# EAGLE schematic OpenHealth_rj45 (EAGLE 7.2.0)
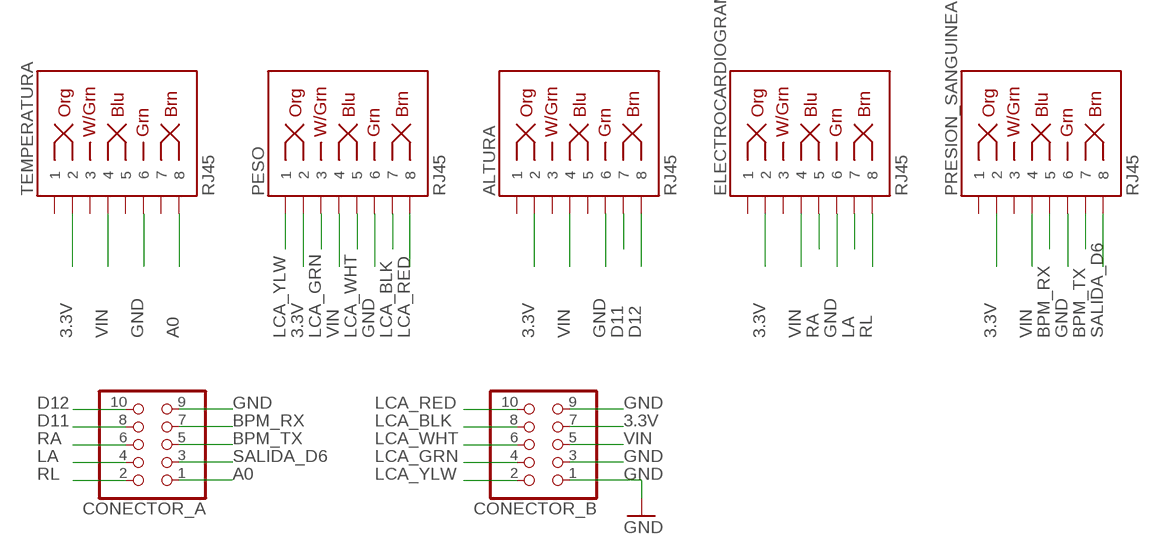
[diagram p0: schematic, sheet 1]

## Parts
ALTURA  RJ45  RJ45-8PTH  [RJ45-8]
CONECTOR_A  PINHD-2X5  [2X05]
CONECTOR_B  PINHD-2X5  [2X05]
ELECTROCARDIOGRAMA  RJ45  RJ45-8PTH  [RJ45-8]
PESO  RJ45  RJ45-8PTH  [RJ45-8]
PRESION_SANGUINEA  RJ45  RJ45-8PTH  [RJ45-8]
TEMPERATURA  RJ45  RJ45-8PTH  [RJ45-8]

## Nets
3.3V: ALTURA.2 CONECTOR_B.7 ELECTROCARDIOGRAMA.2 PESO.2 PRESION_SANGUINEA.2 TEMPERATURA.2
A0: CONECTOR_A.1 TEMPERATURA.8
BPM_RX: CONECTOR_A.7 PRESION_SANGUINEA.5
BPM_TX: CONECTOR_A.5 PRESION_SANGUINEA.7
D11: ALTURA.7 CONECTOR_A.8
D12: ALTURA.8 CONECTOR_A.10
GND: ALTURA.6 CONECTOR_A.9 CONECTOR_B.1 CONECTOR_B.3 CONECTOR_B.9 ELECTROCARDIOGRAMA.6 PESO.6 PRESION_SANGUINEA.6 TEMPERATURA.6
LA: CONECTOR_A.4 ELECTROCARDIOGRAMA.7
LCA_BLK: CONECTOR_B.8 PESO.7
LCA_GRN: CONECTOR_B.4 PESO.3
LCA_RED: CONECTOR_B.10 PESO.8
LCA_WHT: CONECTOR_B.6 PESO.5
LCA_YLW: CONECTOR_B.2 PESO.1
RA: CONECTOR_A.6 ELECTROCARDIOGRAMA.5
RL: CONECTOR_A.2 ELECTROCARDIOGRAMA.8
SALIDA_D6: CONECTOR_A.3 PRESION_SANGUINEA.8
VIN: ALTURA.4 CONECTOR_B.5 ELECTROCARDIOGRAMA.4 PESO.4 PRESION_SANGUINEA.4 TEMPERATURA.4
Unconnected: ALTURA.1 ALTURA.3 ALTURA.5 ELECTROCARDIOGRAMA.1 ELECTROCARDIOGRAMA.3 PRESION_SANGUINEA.1 PRESION_SANGUINEA.3 TEMPERATURA.1 TEMPERATURA.3 TEMPERATURA.5 TEMPERATURA.7

## Library data of the parts
ALTURA ELECTROCARDIOGRAMA PESO PRESION_SANGUINEA TEMPERATURA = SparkFun-Connectors:RJ45-8: RJ45 Jack Simple RJ45, 8-pin connection - connector for common Cat5, Cat5e, and Cat6 Ethernet cables. Footprint not yet proven in production. Connector sku is PRT-00643; Breakout PCB sku is BOB-00716.; PROD_ID: CONN-08506
CONECTOR_A CONECTOR_B = pinhead:PINHD-2X5: PIN HEADER